# Altium schematic sheet 0033.SchDoc
size A4
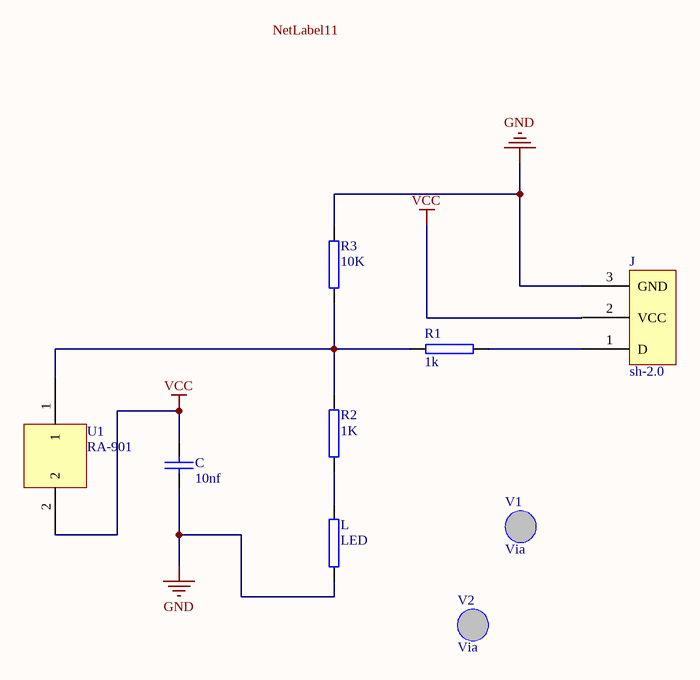
[diagram p0: 0033.SchDoc]

## Parts
C  10nf  [0402]
J  sh-2.0  [sh-2.0]
L  LED  [0402]
R1  1k  [0402]
R2  1K  [0402]
R3  10K  [0402]
U1  RA-901  [RA-901]
V1  Via  [Via]
V2  Via  [Via]

## Nets
GND: C.2 J.3(GND) L.1 R3.2
VCC: C.1 J.2(VCC) U1.2
NetJ_1: J.1(D) R1.2
NetL_2: L.2 R2.1
NetR1_1: R1.1 R2.2 R3.1 U1.1

## Notes on the sheet
- Labels drawn without touching a wire or pin: NetLabel11

## Library data of the parts
C = CAP0402
L R1-R3 = RES0402